# EAGLE design board (EAGLE 7.2.0)
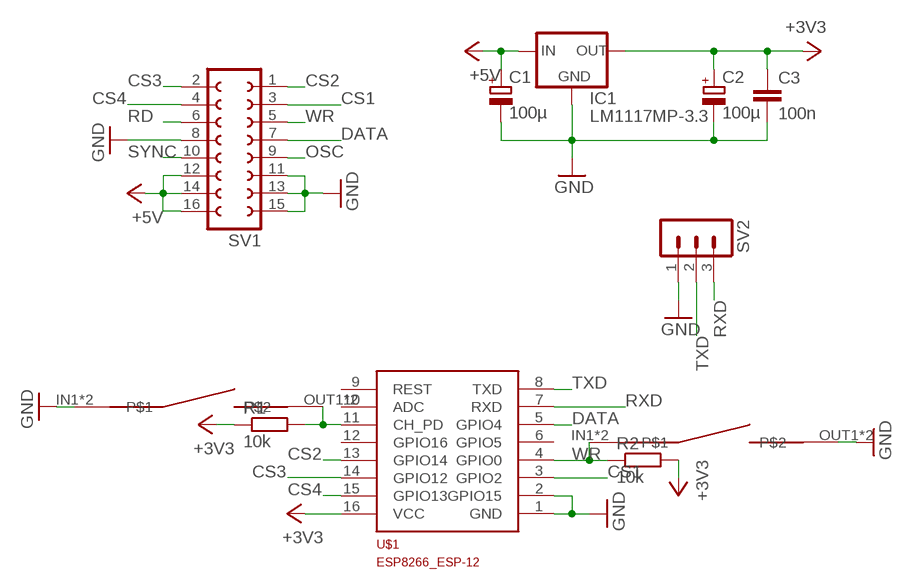
[diagram p0: schematic, sheet 1]

## Parts
C1  100µ  CPOL-EUE2.5-6  [E2,5-6]
C2  100µ  CPOL-EUE2.5-6  [E2,5-6]
C3  100n  C-EUC0805  [C0805]
IC1  LM1117MP-3.3  [SOT223]
R1  10k  R-EU_R0805  [R0805]
R2  10k  R-EU_R0805  [R0805]
SV1  FE08-2  [FE08-2]
SV2  MA03-1  [MA03-1]
U$1  ESP8266_ESP-12  [ESP8266-ESP12]
U$2  KMR221  [KMR221]
U$3  KMR221  [KMR221]

## Nets
+3V3: C2.+ C3.1 IC1.2(OUT) IC1.4(OUT) R1.1 R2.2 U$1.16(VCC)
+5V: C1.+ IC1.3(IN) SV1.12 SV1.14 SV1.16
CS1: SV1.3 U$1.3(GPIO2)
CS2: SV1.1 U$1.13(GPIO14)
CS3: SV1.2 U$1.14(GPIO12)
CS4: SV1.4 U$1.15(GPIO13)
DATA: SV1.7 U$1.5(GPIO4)
GND: C1.- C2.- C3.2 IC1.1(GND) SV1.8 SV1.11 SV1.13 SV1.15 SV2.1 U$1.1(GND) U$1.2(GPIO15) U$2.IN1 U$2.IN2 U$3.OUT1 U$3.OUT2
N$1: R1.2 U$1.11(CH_PD) U$2.OUT1 U$2.OUT2
OSC: SV1.9
RD: SV1.6
RXD: SV2.3 U$1.7(RXD)
SYNC: SV1.10
TXD: SV2.2 U$1.8(TXD)
WR: R2.1 SV1.5 U$1.4(GPIO0) U$3.IN1 U$3.IN2
Unconnected: U$1.6(GPIO5) U$1.9(REST) U$1.10(ADC) U$1.12(GPIO16)

## Library data of the parts
C1 C2 = rcl:CPOL-EU: POLARIZED CAPACITOR, European symbol
C3 = rcl:C-EU: CAPACITOR, European symbol
IC1 = lm1117_11:LM1117?-*: 800mA Low-Dropout Linear Regulator Source: http://www.ti.com/lit/ds/symlink/lm1117-n.pdf; MF: Texas Instruments; MPN: LM1117MP-3.3; OC_FARNELL: 9778195; OC_NEWARK: 28X3416
R1 R2 = rcl:R-EU_: RESISTOR, European symbol
SV1 = con-lsta:FE08-2: FEMALE HEADER; OC_FARNELL: unknown; OC_NEWARK: unknown
SV2 = con-lstb:MA03-1: PIN HEADER; OC_FARNELL: unknown; OC_NEWARK: unknown
U$1 = ESP8266-ESP12:ESP8266_ESP-12
U$2 U$3 = KMR221:KMR221

## Board
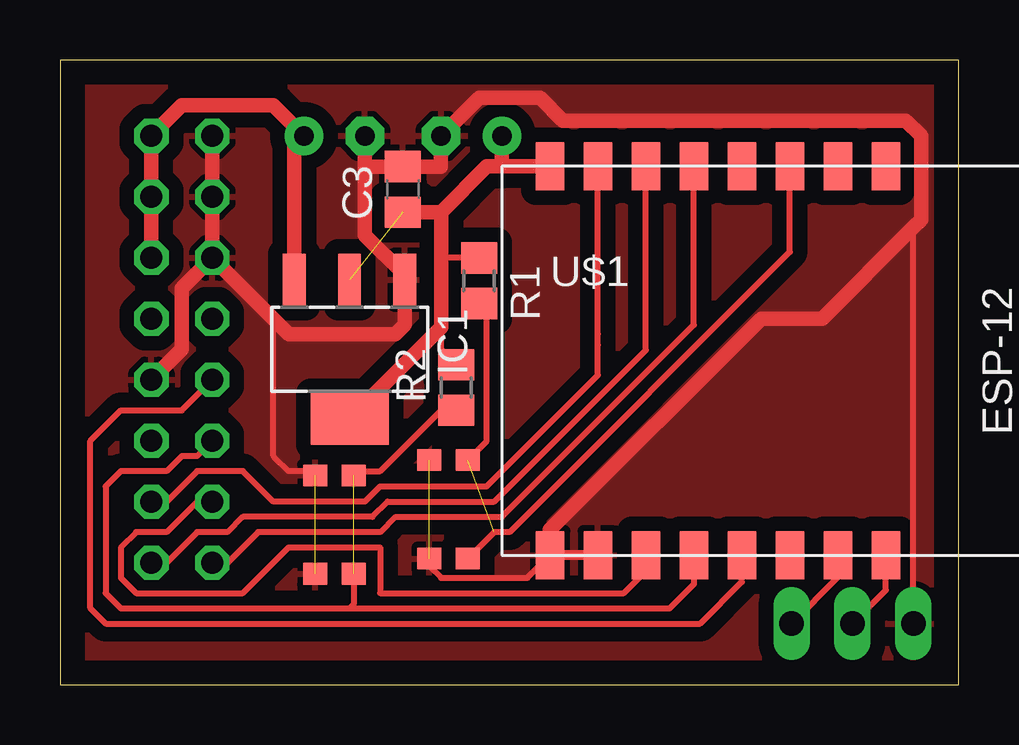
[diagram p1: board, top side]
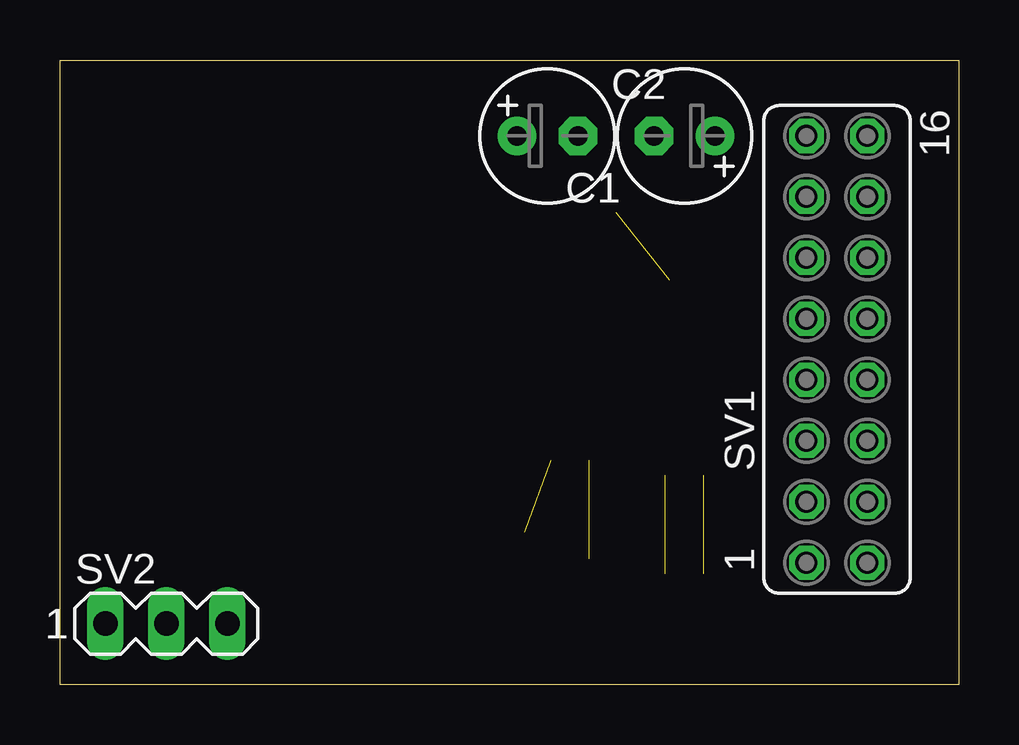
[diagram p2: board, bottom side, seen from below]

Size 37.45 x 26.02 mm. Coordinates in mm from the lower left corner, seen from the top.
Outline: 0,0 37.45,0 37.45,26.02 0,26.02 0,0
Copper layers (1*16): Top 0.035mm / dielectric 1.5mm / Bottom 0.035mm
Design rules "default": minimum track width 10mil, minimum drill 24mil, track to track 8mil, track to pad 8mil, pad to pad 8mil, via to via 8mil, smd to smd 8mil, copper to edge 40mil, drill to drill 8mil, minimum pad ring 10mil, minimum via ring 8mil, stop-mask expansion 4mil, vias tented up to drill 0mil, thermal gap 10mil

### Footprints (pad centres in the part's own frame; a part is rotated, then mirrored left to right if it is on the bottom)
E2,5-6 = drill 0.813 pad 1.6: + -1.27,0 | drill 0.813 pad 1.6 octagon: - 1.27,0
C0805 = smd 1.3 x 1.5: 1 -0.95,0; 2 0.95,0
SOT223 = smd 0.95 x 2.15: 1 -2.3,-2.9; 2 0,-2.9; 3 2.3,-2.9 | smd 3.25 x 2.15: 4 0,2.9
R0805 = smd 1.3 x 1.5: 1 -0.95,0; 2 0.95,0
FE08-2 = drill 0.914 octagon: 1 -8.89,1.27; 2 -8.89,-1.27; 3 -6.35,1.27; 4 -6.35,-1.27; 5 -3.81,1.27; 6 -3.81,-1.27; 7 -1.27,1.27; 8 -1.27,-1.27; 9 1.27,1.27; 10 1.27,-1.27; 11 3.81,1.27; 12 3.81,-1.27; 13 6.35,1.27; 14 6.35,-1.27; 15 8.89,1.27; 16 8.89,-1.27
MA03-1 = drill 1.016 long: 1 -2.54,0; 2 0,0; 3 2.54,0
ESP8266-ESP12 = smd 2 x 1.2: 1 16.2,2; 2 16.2,4; 3 16.2,6; 4 16.2,8; 5 16.2,10; 6 16.2,12; 7 16.2,14; 8 16.2,16; 9 0,16; 10 0,14; 11 0,12; 12 0,10; 13 0,8; 14 0,6; 15 0,4; 16 0,2
KMR221 = smd 0.9 x 1: IN1 -2.05,0.8; IN2 2.05,0.8; OUT1 -2.05,-0.8; OUT2 2.05,-0.8

### Placement (x,y rotation side)
C1  11.43,22.86 180 bottom
C2  17.14,22.86 0 bottom
C3  14.29,20.64 90 top
IC1  12.06,13.97 180 top
R1  17.46,16.83 270 top
R2  16.51,12.38 90 top
SV1  5.08,13.97 90 bottom
SV2  33.02,2.54 0 bottom
U$1  18.41,21.59 270 top
U$2  16.19,7.3 90 top
U$3  11.43,6.67 270 top

### Tracks (layer width: path | path; a pad name or v marks a point on that pad's centre or on a via)
+3V3  (1 unrouted)
  Top 0.254: R2.2 15.88,13.97 15.88,15.24 | R1.1 15.88,17.78
  Top 0.61: 15.88,19.68 15.88,17.78 15.88,15.24 15.88,14.88 IC1.4 | 15.88,19.68 15.87,19.69 C3.1 | U$1.16 18.41,21.59 | 18.41,21.59 17.78,21.59 15.88,19.68 | C2.+ 18.41,21.59
+5V
  Top 0.61: SV1.12 SV1.14 SV1.16 5.08,24.13 8.89,24.13 9.77,23.25 9.77,23.1 | 9.77,23.1 IC1.3 | C1.+ 9.77,23.1
CS1
  Top 0.254: SV1.3 5.71,7.62 4.45,6.35 3.17,6.35 2.54,5.71 2.54,4.45 3.17,3.81 7.62,3.81 9.53,5.71 13.34,5.71 13.34,3.81 23.5,3.81 24.41,4.73 U$1.3
CS2
  Top 0.254: SV1.1 6.99,5.08 8.26,6.35 13.34,6.35 13.97,6.99 18.41,6.99 26.41,14.98 U$1.13
CS3
  Top 0.254: SV1.2 4.45,5.08 5.71,6.35 6.99,6.35 7.62,6.99 13.02,6.99 13.65,7.62 18.1,7.62 24.41,13.94 U$1.14
CS4
  Top 0.254: SV1.4 4.45,7.62 5.71,8.89 7.62,8.89 8.89,7.62 12.7,7.62 13.34,8.26 17.78,8.26 22.41,12.89 22.41,14.16 22.41,14.61 U$1.15
DATA
  Top 0.254: SV1.7 5.08,11.43 2.54,11.43 1.27,10.16 1.27,3.17 1.91,2.54 26.67,2.54 28.41,4.29 U$1.5
GND  (2 unrouted)
  Top 0.254: 10.63,14.44 10.79,14.61 | U$3.OUT1 10.46,8.89 9.53,8.89 8.89,9.53 8.89,15.24 | SV2.1 35.56,19.05 | U$2.IN1 15.39,4.93 15.88,4.45 19.47,4.45 U$1.1
  Top 0.406: U$1.2 U$1.1
  Top 0.61: SV1.15 SV1.13 SV1.11 | SV1.11 8.89,15.24 9.53,14.61 10.79,14.61 13.97,14.61 14.37,15 IC1.1 14.37,17.07 12.7,18.73 12.7,21.59 | SV1.8 5.08,13.97 5.08,16.51 SV1.11 | U$1.1 20.41,6.45 29.21,15.24 31.75,15.24 35.56,19.05 35.88,19.37 35.88,22.86 35.24,23.5 20.95,23.5 20,24.45 17.46,24.45 C2.- 15.87,21.59 C3.2 12.7,21.59 | C1.- 12.7,21.59
  pour Top (isolate 0.61): 0.64,0.64 0.64,25.4 36.83,25.4 36.83,0.64
N$1  (1 unrouted)
  Top 0.254: U$1.11 30.41,18.03 18.73,6.35 18.09,6.35 U$2.OUT1 | R1.2 17.78,15.56 17.78,10.14 U$2.OUT2
RXD
  Top 0.254: SV2.3 32.41,4.47 U$1.7
TXD
  Top 0.254: SV2.2 34.41,3.94 U$1.8
WR  (1 unrouted)
  Top 0.254: SV1.5 5.71,9.53 5.08,9.53 4.45,8.89 2.54,8.89 1.91,8.26 1.91,3.81 2.54,3.17 12.06,3.17 | 12.06,3.17 25.4,3.17 26.41,4.19 U$1.4 | U$3.IN2 12.23,3.34 12.06,3.17 | U$3.IN1 12.4,8.89 13.34,8.89 15.88,11.43 R2.1